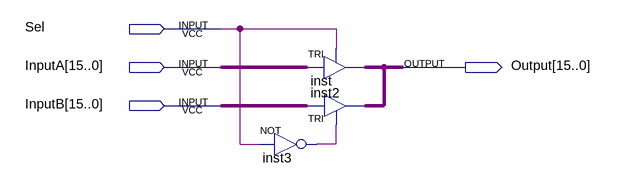
[diagram p0: schematic sheet]
// Quartus schematic mux16.bdf as structural Verilog: 3 symbols, 4 pins
module mux16 (
  input  Sel,
  input  [15:0] InputA,
  input  [15:0] InputB,
  output [15:0] Output
);

  wire inst3_out;

  not inst3 (inst3_out, Sel);
  TRI inst[15:0] (.IN(InputA), .OE(Sel), .OUT(Output));
  TRI inst2[15:0] (.IN(InputB), .OE(inst3_out), .OUT(Output));
endmodule
